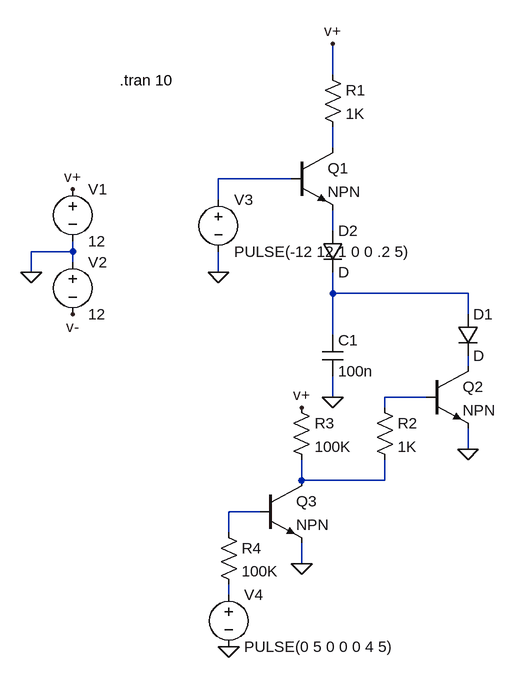
[diagram p0: schematic analog-latch.asc]
analog-latch.asc, the LTspice schematic file:
Version 4
SHEET 1 880 848
WIRE 240 -48 240 -96
WIRE 240 64 240 32
WIRE 176 112 64 112
WIRE 64 144 64 112
WIRE 240 192 240 160
WIRE -160 224 -160 208
WIRE -160 224 -224 224
WIRE -160 240 -160 224
WIRE -224 256 -224 224
WIRE 64 256 64 224
WIRE 240 288 240 256
WIRE 448 288 240 288
WIRE 448 320 448 288
WIRE 240 352 240 288
WIRE 448 400 448 384
WIRE 240 448 240 416
WIRE 384 448 320 448
WIRE 320 464 320 448
WIRE 448 528 448 496
WIRE 192 576 192 544
WIRE 320 576 320 544
WIRE 320 576 192 576
WIRE 128 624 80 624
WIRE 80 656 80 624
WIRE 192 704 192 672
WIRE 80 752 80 736
FLAG 240 -96 v+
FLAG -160 128 v+
FLAG -160 320 v-
FLAG 64 256 0
FLAG 240 448 0
FLAG -224 256 0
FLAG 448 528 0
FLAG 80 832 0
FLAG 192 704 0
FLAG 192 464 v+
SYMBOL voltage -160 112 R0
SYMATTR InstName V1
SYMATTR Value 12
SYMBOL voltage -160 224 R0
SYMATTR InstName V2
SYMATTR Value 12
SYMBOL voltage 64 128 R0
SYMATTR InstName V3
SYMATTR Value PULSE(-12 12 1 0 0 .2 5)
SYMBOL npn 176 64 R0
SYMATTR InstName Q1
SYMBOL res 224 -64 R0
SYMATTR InstName R1
SYMATTR Value 1K
SYMBOL cap 224 352 R0
SYMATTR InstName C1
SYMATTR Value 100n
SYMBOL voltage 80 736 R0
SYMATTR InstName V4
SYMATTR Value PULSE(0 5 0 0 0 4 5)
SYMBOL npn 384 400 R0
SYMATTR InstName Q2
SYMBOL diode 432 320 R0
SYMATTR InstName D1
SYMBOL diode 224 192 R0
SYMATTR InstName D2
SYMBOL res 304 448 R0
SYMATTR InstName R2
SYMATTR Value 1K
SYMBOL npn 128 576 R0
SYMATTR InstName Q3
SYMBOL res 176 448 R0
SYMATTR InstName R3
SYMATTR Value 100K
SYMBOL res 64 640 R0
SYMATTR InstName R4
SYMATTR Value 100K
TEXT -88 -40 Left 2 !.tran 10

The netlist it stands for:
* analog-latch.asc
V1 v+ 0 12
V2 0 v- 12
V3 N002 0 PULSE(-12 12 1 0 0 .2 5)
Q1 N001 N002 N003 0 NPN
R1 v+ N001 1K
C1 N004 0 100n
V4 N009 0 PULSE(0 5 0 0 0 4 5)
Q2 N005 N006 0 0 NPN
D1 N004 N005 D
D2 N003 N004 D
R2 N006 N007 1K
Q3 N007 N008 0 0 NPN
R3 v+ N007 100K
R4 N008 N009 100K
.model D D
.lib standard.dio
.model NPN NPN
.model PNP PNP
.lib standard.bjt
.tran 10
.backanno
.end